# EAGLE design busy_cube (EAGLE 8.5.2)
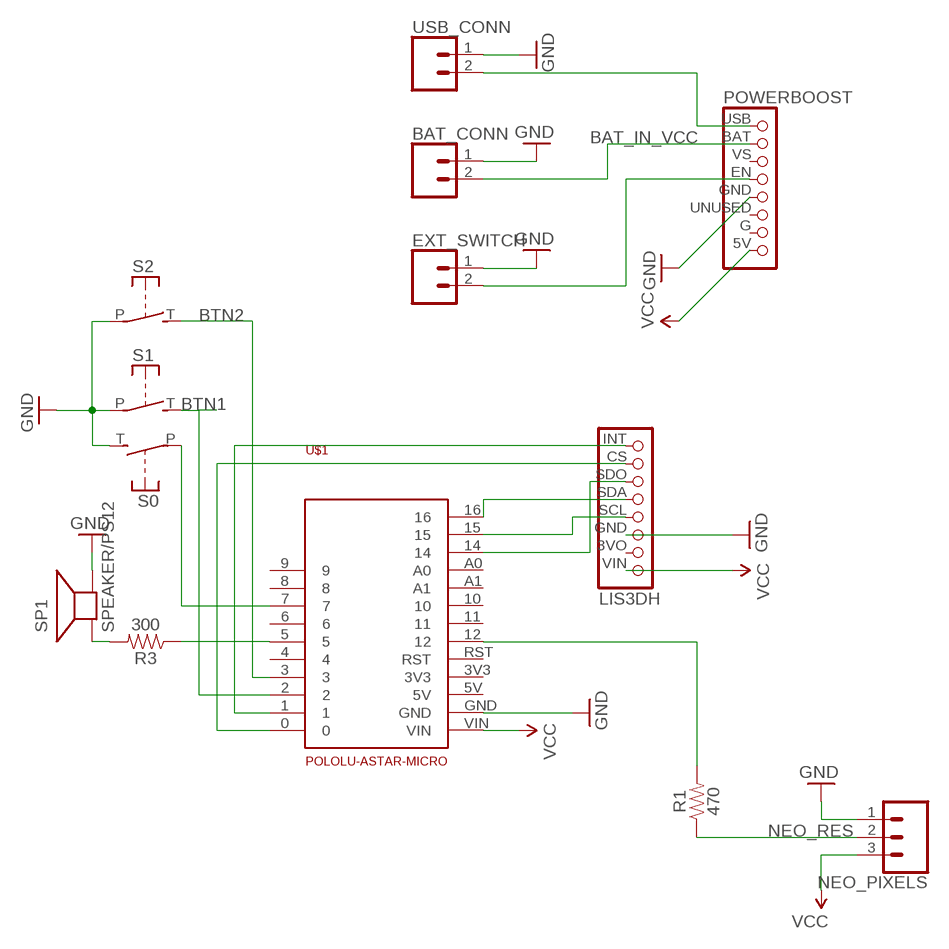
[diagram p0: schematic, sheet 1]

## Parts
BAT_CONN  CONN_02-JST-2MM-SMT  [JST-2-SMD]
EXT_SWITCH  CONN_02-JST-2MM-SMT  [JST-2-SMD]
LIS3DH  ADA-LIS3DHPADS_ONLY  [LIS3DH-1X08]
NEO_PIXELS  CONN_03LONGPADS  [1X03_LONGPADS]
POWERBOOST  ADA-POWERBOOST-1000CPADS-ONLY  [POWERBOOST-1X08]
R1  470  RESISTORAXIAL-0.3  [AXIAL-0.3]
R3  300  RESISTORAXIAL-0.3  [AXIAL-0.3]
S0  ADA-ARCADE-BTN30MM  [ARCADE-BTN-30MM]
S1  ADA-ARCADE-BTN30MM  [ARCADE-BTN-30MM]
S2  ADA-ARCADE-BTN30MM  [ARCADE-BTN-30MM]
SP1  SPEAKER/PS12  [PS12]
U$1  POLOLU-ASTAR-MICRO  [POLOLU-ASTAR-MICRO]
USB_CONN  CONN_02-JST-2MM-SMT  [JST-2-SMD]

## Nets
BAT_IN_VCC: BAT_CONN.2 POWERBOOST.BAT(3VO)
BTN1: S1.T(S) U$1.2
BTN2: S2.T(S) U$1.3
GND: BAT_CONN.1 EXT_SWITCH.1 LIS3DH.GND NEO_PIXELS.1 POWERBOOST.GND(SDA) S0.T(S) S1.P S2.P SP1.P$2(-) U$1.GND USB_CONN.1
N$1: LIS3DH.INT U$1.1
N$2: R1.P$2 U$1.12
N$3: LIS3DH.CS U$1.0
N$4: LIS3DH.SDO U$1.14
N$5: LIS3DH.SDA U$1.16
N$6: LIS3DH.SCL U$1.15
N$9: R3.P$2 SP1.P$1(+)
N$10: EXT_SWITCH.2 POWERBOOST.EN(SCL)
N$11: S0.P U$1.7
NEO_RES: NEO_PIXELS.2 R1.P$1
SPKR: R3.P$1 U$1.5
USB_IN_VCC: POWERBOOST.USB(VIN) USB_CONN.2
VCC: LIS3DH.VIN NEO_PIXELS.3 POWERBOOST.5V(INT) U$1.VIN
Unconnected: LIS3DH.3VO POWERBOOST.G(CS) POWERBOOST.UNUSED(SDO) POWERBOOST.VS(GND) U$1.4 U$1.6 U$1.8 U$1.9 U$1.10 U$1.11 U$1.A0 U$1.A1 U$1.RST

## Power pins joined to a net without a drawn wire
3V3: U$1.3V3
5V: U$1.5V

## Library data of the parts
BAT_CONN EXT_SWITCH USB_CONN = busy_cube_lib:CONN_02: Multi connection point. Often used as Generic Header-pin footprint for 0.1 inch spaced/style header connections On any of the 0.1 inch spaced packages, you can populate with these: Break Away Headers - Straight <https://www.sparkfun.com/products/116> (PRT-00116) Break Away Male Headers - Right Angle <https://www.sparkfun.com/products/553> (PRT-00553) Female Headers <https://www.sparkfun.com/products/115> (PRT-00115) Break Away Headers - Machine Pin <https://www.sparkfun.com/products/117> (PRT-00117) Break Away Female Headers - Swiss Machine Pin <https://www.sparkfun.com/products/743> (PRT-00743) For SCREWTERMINALS and SPRING TERMINALS visit here: Screw Terimnals on SparkFun.com <https://www.sparkfun.com/search/results?term=Screw+Terminals> (5mm/3.5mm/2.54mm spacing) This device is also useful as a general connection point to wire up your design to another part of your project. Our various solder wires solder well into these plated through hole pads. Hook-Up Wire - Assortment (Stranded, 22 AWG) <https://www.sparkfun.com/products/11375> (PRT-11375) Hook-Up Wire - Assortment (Solid Core, 22 AWG) <https://www.sparkfun.com/products/11367> (PRT-11367) View the entire wire category on our website here <https://www.sparkfun.com/categories/141> Special notes: Molex polarized connector foot print use with: PRT-08233 with associated crimp pins and housings. 2.54_SCREWTERM for use with PRT-10571. 3.5mm Screw Terminal footprints for PRT-08084 5mm Screw Terminal footprints for use with PRT-08432; PROD_ID: CONN-11443
LIS3DH = busy_cube_lib:ADA-LIS3DH: Breakout pins for Adafruit LIS3DH
NEO_PIXELS = busy_cube_lib:CONN_03: Multi connection point. Often used as Generic Header-pin footprint for 0.1 inch spaced/style header connections On any of the 0.1 inch spaced packages, you can populate with these: Break Away Headers - Straight <https://www.sparkfun.com/products/116> (PRT-00116) Break Away Male Headers - Right Angle <https://www.sparkfun.com/products/553> (PRT-00553) Female Headers <https://www.sparkfun.com/products/115> (PRT-00115) Break Away Headers - Machine Pin <https://www.sparkfun.com/products/117> (PRT-00117) Break Away Female Headers - Swiss Machine Pin <https://www.sparkfun.com/products/743> (PRT-00743) Stackable Header - 3 Pin (Female, 0.1") <https://www.sparkfun.com/products/13875> (PRT-13875) For SCREWTERMINALS and SPRING TERMINALS visit here: Screw Terimnals on SparkFun.com <https://www.sparkfun.com/search/results?term=Screw+Terminals> (5mm/3.5mm/2.54mm spacing) This device is also useful as a general connection point to wire up your design to another part of your project. Our various solder wires solder well into these plated through hole pads. Hook-Up Wire - Assortment (Stranded, 22 AWG) <https://www.sparkfun.com/products/11375> (PRT-11375) Hook-Up Wire - Assortment (Solid Core, 22 AWG) <https://www.sparkfun.com/products/11367> (PRT-11367) View the entire wire category on our website here <https://www.sparkfun.com/categories/141> Special notes: Molex polarized connector foot print use with SKU : PRT-08232 with associated crimp pins and housings.
POWERBOOST = busy_cube_lib:ADA-POWERBOOST-1000C: Breakout pins for Adafruit Powerboost 1000C
R1 R3 = busy_cube_lib:RESISTOR: Generic Resistor Package
S0 S1 S2 = busy_cube_lib:ADA-ARCADE-BTN: Judco 50-0015-00
SP1 = busy_cube_lib:SPEAKER: SPEAKER Source: Buerklin Added PS12 (for part # PS1240 piezo) http://www.ladyada.net/library/pcb/eaglelibrary.html
U$1 = busy_cube_lib:POLOLU-ASTAR-MICRO

## Board
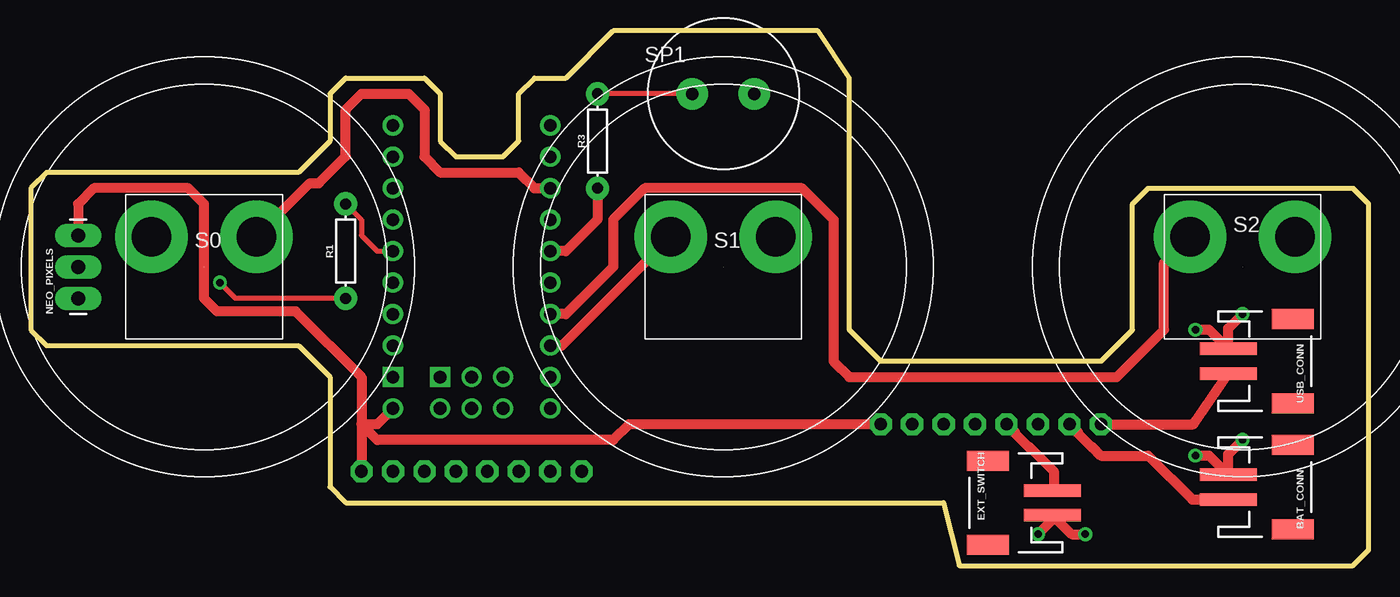
[diagram p1: board, top side]
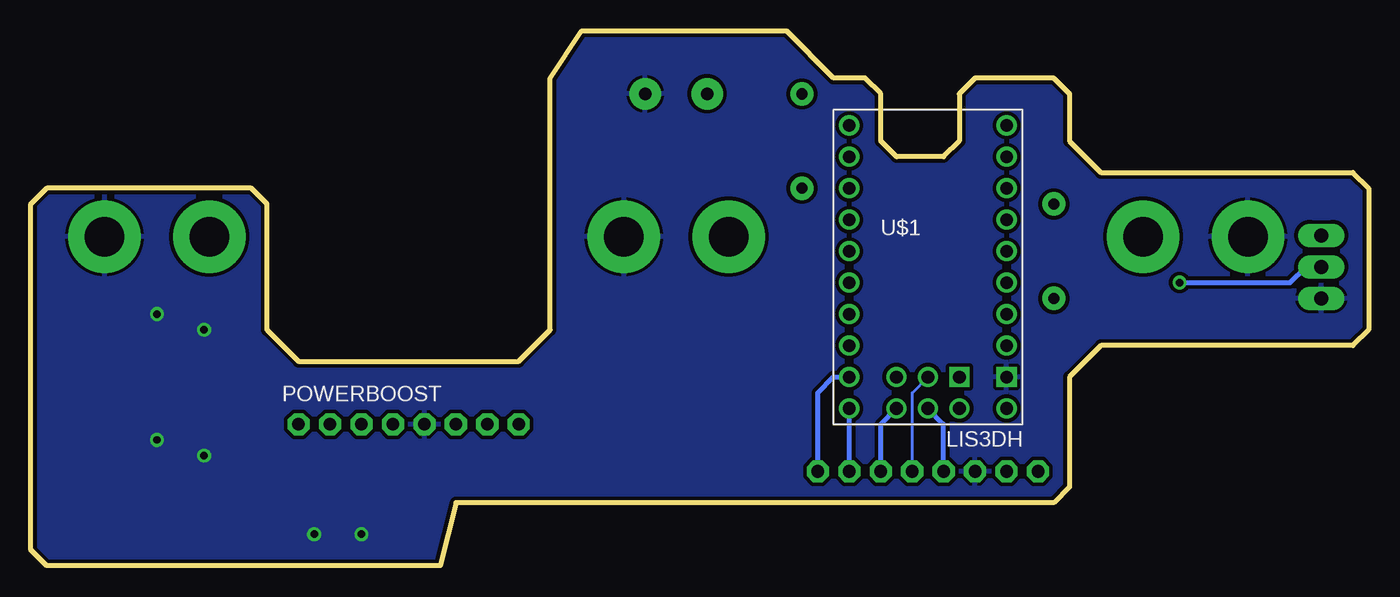
[diagram p2: board, bottom side, seen from below]

Size 107.95 x 43.18 mm. Coordinates in mm from the lower left corner, seen from the top.
Outline: 107.95,29.21 106.68,30.48 90.17,30.48 88.9,29.21 88.9,19.05 86.36,16.51 68.58,16.51 66.04,19.05 66.04,39.37 63.5,43.18 46.99,43.18 43.18,39.37 40.64,39.37 39.37,38.1 39.37,34.29 38.1,33.02 34.29,33.02 33.02,34.29 33.02,38.1 31.75,39.37 25.4,39.37 24.13,38.1 24.13,34.29 21.59,31.75 1.27,31.75 0,30.48 0,19.05 1.27,17.78 21.59,17.78 24.13,15.24 24.13,6.35 25.4,5.08 73.66,5.08 74.93,0 106.68,0 107.95,1.27 107.95,29.21
Copper layers (1*16): Top 0.035mm / dielectric 1.5mm / Bottom 0.035mm
Design rules "SparkFun": minimum track width 8mil, minimum drill 20mil, track to track 8mil, track to pad 8mil, pad to pad 8mil, via to via 8mil, smd to smd 8mil, copper to edge 10mil, drill to drill 8mil, minimum pad ring 12mil, minimum via ring 10mil, stop-mask expansion 4mil, vias tented up to drill 25mil, thermal gap 10mil

### Footprints (pad centres in the part's own frame; a part is rotated, then mirrored left to right if it is on the bottom)
JST-2-SMD = smd 1 x 4.6: 1 -1,-3.7; 2 1,-3.7 | smd 1.6 x 3.4: NC1 -3.4,1.5; NC2 3.4,1.5
LIS3DH-1X08 = drill 1.016 pad 1.778 octagon: 3VO -6.35,0; CS 6.35,0; GND -3.81,0; INT 8.89,0; SCL -1.27,0; SDA 1.27,0; SDO 3.81,0; VIN -8.89,0
1X03_LONGPADS = drill 1.118 pad 1.88 long: 1 0,0; 2 2.54,0; 3 5.08,0
POWERBOOST-1X08 = drill 1.016 pad 1.778 octagon: 5V 8.89,0; BAT -6.35,0; EN -1.27,0; G 6.35,0; GND 1.27,0; UNUSED 3.81,0; USB -8.89,0; VS -3.81,0
AXIAL-0.3 = drill 0.9 pad 1.88: P$1 -3.81,0; P$2 3.81,0
ARCADE-BTN-30MM = drill 3.175 pad 5.842: P 4.224,2.441; T -4.235,2.441
PS12 = drill 1 pad 2.54: P$1 -2.5,0; P$2 2.5,0
POLOLU-ASTAR-MICRO = drill 1.016: 0 -6.35,-11.43; 1 -6.35,-8.89; 2 -6.35,-6.35; 3 -6.35,-3.81; 3V3 6.35,-3.81; 4 -6.35,-1.27; 5 -6.35,1.27; 5V 6.35,-6.35; 6 -6.35,3.81; 7 -6.35,6.35; 8 -6.35,8.89; 9 -6.35,11.43; 10 6.35,6.35; 11 6.35,3.81; 12 6.35,1.27; 14 -2.54,-11.43; 15 0,-11.43; 16 0,-8.89; A0 6.35,11.43; A1 6.35,8.89; P$11 -2.54,-8.89; P$15 2.54,-11.43; RST 6.35,-1.27; VIN 6.35,-11.43 | drill 1.016 square: GND 6.35,-8.89; P$16 2.54,-8.89

### Placement (x,y rotation side)
BAT_CONN  100.33,6.35 270 top
EXT_SWITCH  78.74,5.08 90 top
LIS3DH  35.56,7.62 180 bottom
NEO_PIXELS  3.81,21.59 90 top
POWERBOOST  77.47,11.43 0 bottom
R1  25.4,25.4 90 top
R3  45.72,34.29 90 top
S0  13.97,24.13 0 top
S1  55.88,24.13 0 top
S2  97.79,24.13 0 top
SP1  55.88,38.1 0 top
U$1  35.56,24.13 0 bottom
USB_CONN  100.33,16.51 270 top

### Tracks (layer width: path | path; a pad name or v marks a point on that pad's centre or on a via)
BAT_IN_VCC
  Top 0.813: POWERBOOST.BAT 84.51,10.74 84.51,10.66 85.59,9.58 85.67,9.58 86.36,8.89 90.17,8.89 93.71,5.35 BAT_CONN.2
BTN1
  Top 0.406: 51.55,26.67 S1.T
  Top 0.813: S1.T 42.85,17.78 U$1.2
BTN2
  Top 0.813: S2.T 91.44,24.46 91.44,19.05 87.63,15.24 66.04,15.24 64.77,16.51 64.77,27.94 62.23,30.48 49.53,30.48 46.99,27.94 46.99,24.13 43.18,20.32 U$1.3
GND  (via drill 0.6)
  Top 0.813: v93.98,8.89 95.09,8.89 BAT_CONN.1 96.63,9 v97.79,10.16 | v93.98,19.05 95.09,19.05 USB_CONN.1 96.63,19.16 v97.79,20.32 | v85.09,2.54 83.98,2.54 EXT_SWITCH.1 82.44,3.7 v81.28,2.54
  pour Bottom (isolate 0.305): 0,0 107.95,0 107.95,43.18 0,43.18
N$1
  Bottom 0.406: LIS3DH.INT 44.45,13.97 43.18,15.24 U$1.1
N$2
  Top 0.406: R1.P$2 26.67,27.94 26.67,26.67 27.94,25.4 U$1.12
N$3
  Bottom 0.406: LIS3DH.CS U$1.0
N$4
  Bottom 0.406: LIS3DH.SDO 39.37,11.43 U$1.14
N$5
  Bottom 0.254: LIS3DH.SDA 36.83,13.97 U$1.16
N$6
  Bottom 0.406: LIS3DH.SCL 34.29,11.43 U$1.15
N$9
  Top 0.406: SP1.P$1 R3.P$2
N$10
  Top 0.813: POWERBOOST.EN 79.43,10.74 79.43,10.66 80.52,9.58 80.59,9.58 82.55,7.62 82.55,6.19 EXT_SWITCH.2
N$11
  Top 0.813: S0.P 22.51,30.89 23.22,30.89 25.4,33.07 25.4,36.83 26.67,38.1 30.48,38.1 31.75,36.83 31.75,33.02 33.02,31.75 39.37,31.75 40.64,30.48 U$1.7
NEO_RES  (via drill 0.6)
  Top 0.406: R1.P$1 16.51,21.59 v15.24,22.86
  Bottom 0.406: v15.24,22.86 6.35,22.86 5.08,24.13 NEO_PIXELS.2
SPKR
  Top 0.813: R3.P$1 45.72,27.94 43.18,25.4 U$1.5
USB_IN_VCC
  Top 0.813: POWERBOOST.USB 93.82,11.43 USB_CONN.2
VCC
  Top 0.813: 26.67,11.43 26.67,15.24 21.36,20.55 15.01,20.55 13.97,21.59 13.97,29.21 12.7,30.48 5.08,30.48 3.81,29.21 NEO_PIXELS.3 | 26.67,11.43 LIS3DH.VIN | U$1.VIN 27.94,11.43 26.67,11.43 | POWERBOOST.5V 48.26,11.43 46.99,10.16 27.94,10.16 26.67,11.43